# EAGLE design WS2812B-HueStrip (EAGLE 6.6.0)
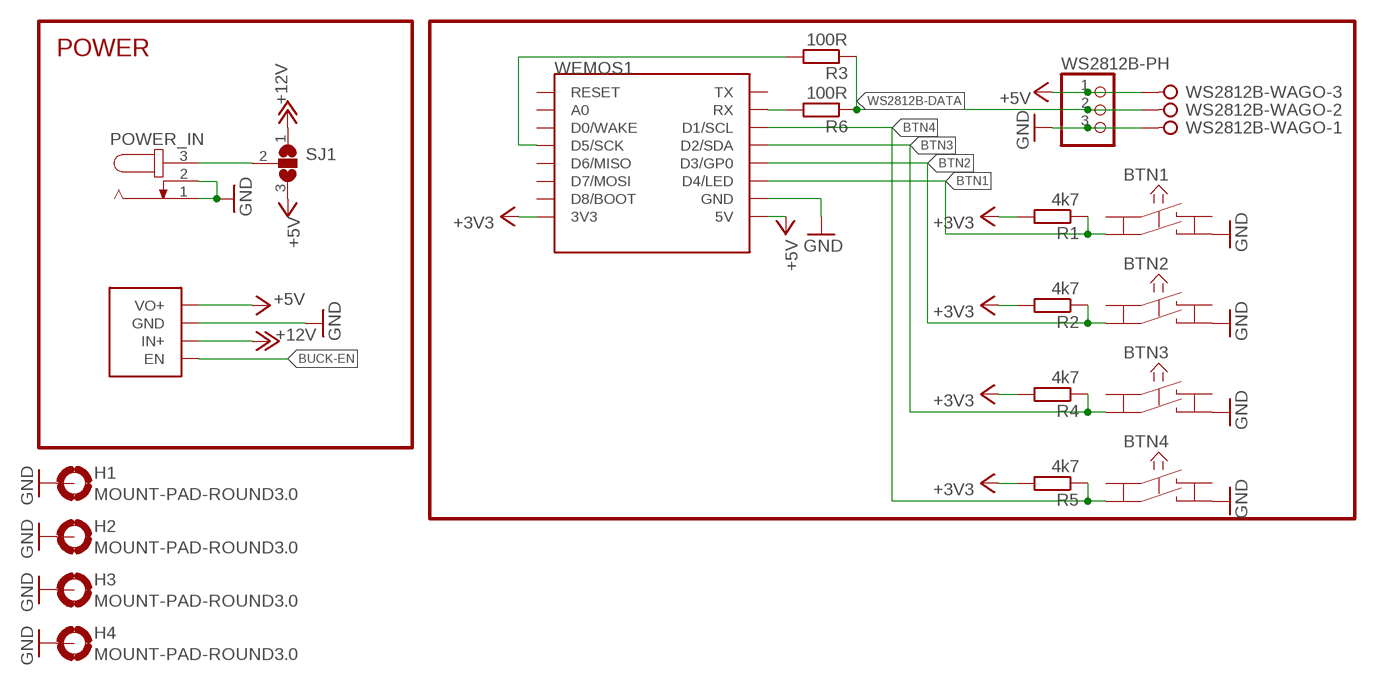
[diagram p0: schematic, sheet 1]

## Parts
BTN1  KSM611A  [KSM611A]
BTN2  KSM611A  [KSM611A]
BTN3  KSM611A  [KSM611A]
BTN4  KSM611A  [KSM611A]
H1  MOUNT-PAD-ROUND3.0  [3,0-PAD]
H2  MOUNT-PAD-ROUND3.0  [3,0-PAD]
H3  MOUNT-PAD-ROUND3.0  [3,0-PAD]
H4  MOUNT-PAD-ROUND3.0  [3,0-PAD]
POWER_IN  RAPC7120  [RAPC712]
R1  4k7  R-EU_MULTI  [MULTI_RESISTOR]
R2  4k7  R-EU_MULTI  [MULTI_RESISTOR]
R3  100R  R-EU_MULTI  [MULTI_RESISTOR]
R4  4k7  R-EU_MULTI  [MULTI_RESISTOR]
R5  4k7  R-EU_MULTI  [MULTI_RESISTOR]
R6  100R  R-EU_MULTI  [MULTI_RESISTOR]
SJ1  SJ2WW  [SJ_2W]
U$1  BUCK_CONVERTER_TE818  [BUCK_CONVERTER_TE818]
WEMOS1  WEMOS-D1-MINI  [WEMOS-D1-MINI]
WS2812B-PH  PINHD-1X03_2.54-S  [1X03-S]
WS2812B-WAGO  W237-3E  [W237-3E]

## Nets
+3V3: R1.2@1 R1.2@2 R2.2@1 R2.2@2 R4.2@1 R4.2@2 R5.2@1 R5.2@2 WEMOS1.3V3
+5V: SJ1.3 U$1.VO+ WEMOS1.5V WS2812B-PH.1 WS2812B-WAGO.3
+12V: SJ1.1 U$1.IN+
BTN1: BTN1.C R1.1@1 R1.1@2 WEMOS1.D4(D4/LED)
BTN2: BTN2.C R2.1@1 R2.1@2 WEMOS1.D3(D3/GP0)
BTN3: BTN3.C R4.1@1 R4.1@2 WEMOS1.D2(D2/SDA)
BTN4: BTN4.C R5.1@1 R5.1@2 WEMOS1.D1(D1/SCL)
BUCK-EN: U$1.EN
GND: BTN1.D BTN2.D BTN3.D BTN4.D H1.B3,0(MOUNT) H2.B3,0(MOUNT) H3.B3,0(MOUNT) H4.B3,0(MOUNT) POWER_IN.1 POWER_IN.2 U$1.GND WEMOS1.GND WS2812B-PH.3 WS2812B-WAGO.1
N$1: POWER_IN.3 SJ1.2
N$2: R3.2@1 R3.2@2 WEMOS1.D5(D5/SCK)
N$3: R6.2@1 R6.2@2 WEMOS1.RX
WS2812B-DATA: R3.1@1 R3.1@2 R6.1@1 R6.1@2 WS2812B-PH.2 WS2812B-WAGO.2
Unconnected: BTN1.A BTN1.B BTN2.A BTN2.B BTN3.A BTN3.B BTN4.A BTN4.B WEMOS1.A0 WEMOS1.D0(D0/WAKE) WEMOS1.D6(D6/MISO) WEMOS1.D7(D7/MOSI) WEMOS1.D8(D8/BOOT) WEMOS1.RESET WEMOS1.TX

## Notes on the sheet
- POWER

## Library data of the parts
BTN1-BTN4 = schalter_taster:KSM611A
H1-H4 = holes:MOUNT-PAD-ROUND: MOUNTING PAD, round
POWER_IN = Arduino Mega 2560:RAPC712: DC POWER JACK Power Jack, DC, Right Angle, Through Hole, Rated 5A at 16VDC, PC Terminals Distributor: Farnell (www.Farnell.de) Drawing: 84N1161.pdf / 84N1162.pdf Manufacturer: SPC Technology (www.spctechnology.com) Type: SPC4077 / SPC 4078
R1-R6 = diyHue:R-EU_MULTI
SJ1 = jumper:SJ2W: SMD solder JUMPER
U$1 = diyHue:BUCK_CONVERTER_TE818
WEMOS1 = esp8266modules:WEMOS-D1-MINI: WeMos.cc D1 mini ESP8266 module
WS2812B-PH = pinhead-2:PINHD-1X03: PIN HEADER
WS2812B-WAGO = con-wago-508:W237-3E: WAGO SREW CLAMP; OC_FARNELL: unknown; OC_NEWARK: unknown

## Board
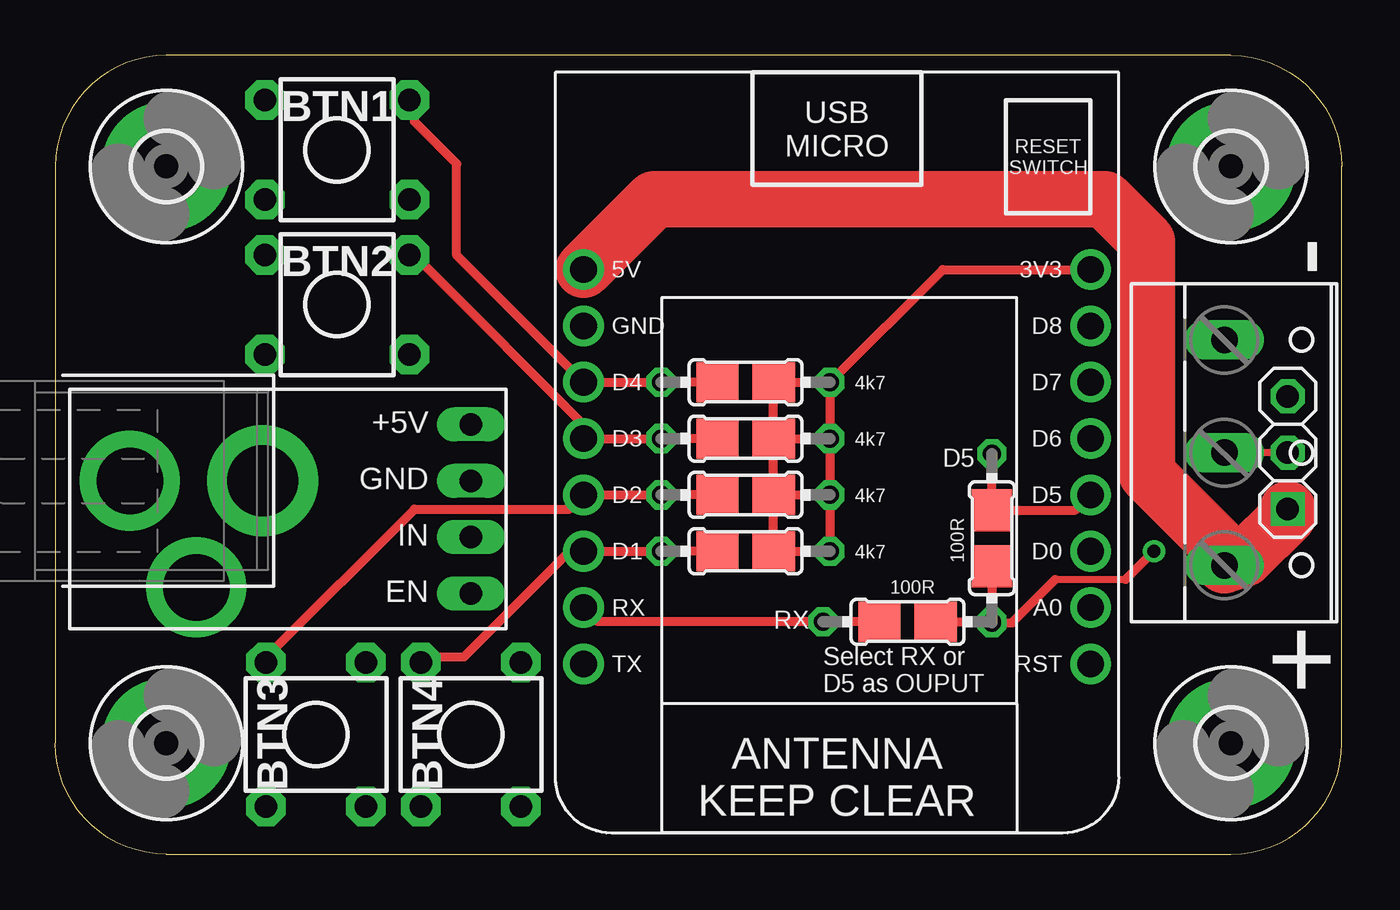
[diagram p1: board, top side]
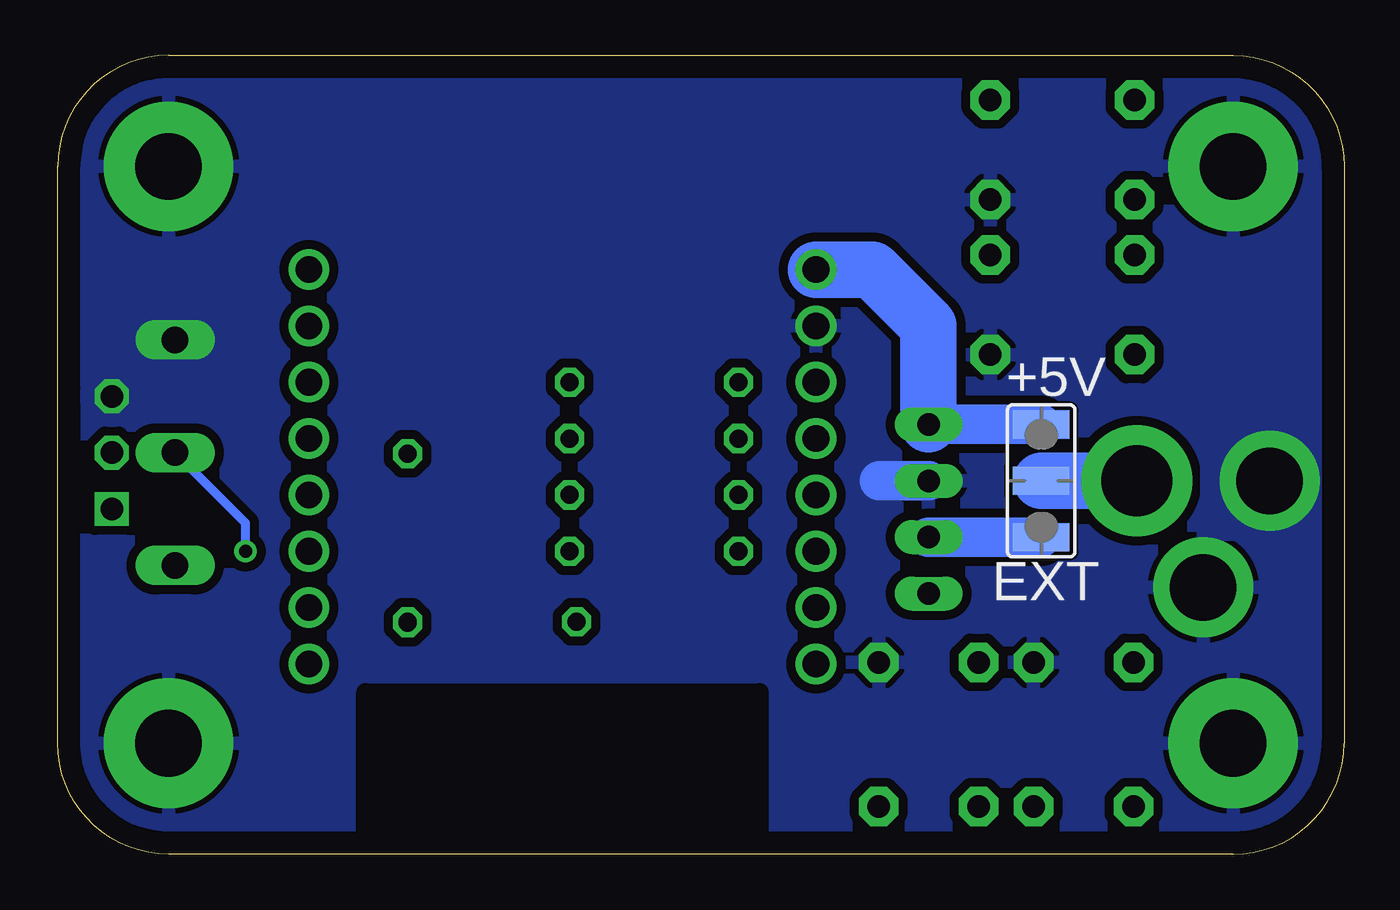
[diagram p2: board, bottom side, seen from below]

Size 58 x 36 mm. Coordinates in mm from the lower left corner, seen from the top.
Outline: 5,0 53,0 arc90 58,5 58,31 arc90 53,36 5,36 arc90 0,31 0,5 arc90 5,0
Copper layers (1*16): Top 0.035mm / dielectric 1.5mm / Bottom 0.035mm
Design rules "default *": minimum track width 10mil, minimum drill 18mil, track to track 8mil, track to pad 8mil, pad to pad 8mil, via to via 8mil, smd to smd 0mil, copper to edge 40mil, drill to drill 8mil, minimum pad ring 10mil, minimum via ring 8mil, stop-mask expansion 4mil, vias tented up to drill 0mil, thermal gap 10mil

### Footprints (pad centres in the part's own frame; a part is rotated, then mirrored left to right if it is on the bottom)
KSM611A = drill 1.016 pad 1.778 octagon: A -3.25,2.25; B -3.25,-2.25; C 3.25,2.25; D 3.25,-2.25
3,0-PAD = drill 3 pad 5.842: B3,0 0,0
RAPC712 = drill 3 pad 4.5: 1 -3,0; 2 0,-4.8 | drill 3.2 pad 5: 3 3,0
MULTI_RESISTOR = drill 0.813 octagon: 1@1 -3.81,0; 2@1 3.81,0 | smd 1.905 x 1.803: 1@2 -1.266,0; 2@2 1.266,0
SJ_2W = smd 1.27 x 2.54: 1 -2.54,0; 2 0,0; 3 2.54,0
BUCK_CONVERTER_TE818 = drill 1.016 long: EN 0,3.81; GND 0,-1.27; IN+ 0,1.27; VO+ 0,-3.81
WEMOS-D1-MINI = drill 1.2 pad 1.829: 3V3 -10.16,-10.16; 5V 12.7,-10.16; A0 -10.16,5.08; D0 -10.16,2.54; D1 12.7,2.54; D2 12.7,0; D3 12.7,-2.54; D4 12.7,-5.08; D5 -10.16,0; D6 -10.16,-2.54; D7 -10.16,-5.08; D8 -10.16,-7.62; GND 12.7,-7.62; RESET -10.16,7.62; RX 12.7,5.08; TX 12.7,7.62
1X03-S = drill 1.016 square: 1 -2.54,0 | drill 1.016 octagon: 2 0,0; 3 2.54,0
W237-3E = drill 1.194 long: 1 -5.08,-0.635; 2 0,-0.635; 3 5.08,-0.635

### Placement (x,y rotation side)
BTN1  12.7,31.75 0 top
BTN2  12.7,24.77 0 top
BTN3  11.75,5.4 90 top
BTN4  18.73,5.4 90 top
H1  5,31 0 top
H2  53,31 0 top
H3  53,5 0 top
H4  5,5 0 top
POWER_IN  6.35,16.83 0 top
R1  31.11,21.27 0 top
R2  31.11,18.73 0 top
R3  42.23,14.24 90 top
R4  31.11,16.19 0 top
R5  31.11,13.65 0 top
R6  38.42,10.48 180 top
SJ1  13.65,16.83 90 bottom
U$1  18.73,15.56 180 top
WEMOS1  36.51,16.19 180 top
WS2812B-PH  55.56,18.1 90 top
WS2812B-WAGO  53.34,18.1 270 top

### Tracks (layer width: path | path; a pad name or v marks a point on that pad's centre or on a via)
+3V3
  Top 0.406: R4.2@1 R5.2@1 R5.2@2 R4.2@2 | R2.2@1 R4.2@1 | R1.2@1 R2.2@1 | WEMOS1.3V3 40.01,26.35 R1.2@1 | R1.2@1 R1.2@2 R2.2@2 | R2.2@2 R2.2@1 | R4.2@2 R4.2@1 | R4.2@2 R2.2@2
+5V
  Top 2.54: WS2812B-PH.1 55.56,15.24 53.66,13.34 WS2812B-WAGO.3 52.39,13.34 52.39,13.97 49.21,17.14 49.21,27.62 47.31,29.53 26.99,29.53 WEMOS1.5V
  Bottom 1.778: SJ1.3 U$1.VO+
  Bottom 2.54: U$1.VO+ 18.73,23.81 21.27,26.35 WEMOS1.5V
+12V
  Bottom 1.778: SJ1.1 U$1.IN+
BTN1
  Top 0.406: BTN1.C 16.19,33.97 16.19,33.02 18.1,31.11 18.1,26.99 WEMOS1.D4 R1.1@1 R1.1@2
BTN2
  Top 0.406: 24.45,18.73 R2.1@1 R2.1@2 | 24.45,18.73 16.19,26.99 BTN2.C | 24.45,18.73 WEMOS1.D3
BTN3
  Top 0.406: BTN3.C 9.53,8.89 16.19,15.56 23.18,15.56 WEMOS1.D2 R4.1@1 R4.1@2
BTN4
  Top 0.406: BTN4.C 16.51,8.89 18.41,8.89 23.18,13.65 WEMOS1.D1 R5.1@1 R5.1@2
GND
  Bottom 1.778: U$1.GND 20.95,16.83
  pour Bottom (isolate 0.406): -0.95,37.47 59.07,37.47 59.07,-0.95 -0.95,-0.95
  pour Bottom (no thermals): -1.91,20.95 6.35,20.95 6.35,14.29 -1.91,14.29
  pour Bottom (isolate 0.406, no thermals): 50.8,25.08 56.83,25.08 56.83,11.11 50.8,11.11
N$1
  Bottom 2.54: POWER_IN.3 SJ1.2
N$2
  Top 0.406: WEMOS1.D5 45.99,15.51 R3.2@2 R3.2@1
N$3
  Top 0.406: R6.2@2 R6.2@1 24.45,10.48 WEMOS1.RX
WS2812B-DATA  (via drill 0.6)
  Top 0.305: WS2812B-PH.2 WS2812B-WAGO.2 | 45.09,12.38 48.26,12.38
  Top 0.406: R3.1@2 R6.1@1 R3.1@1 | R3.1@1 43.13,10.43 45.09,12.38 | 48.26,12.38 v49.53,13.65 | R6.1@2 42.18,10.48 R3.1@1
  Bottom 0.406: v49.53,13.65 49.53,14.92 WS2812B-WAGO.2

### Text on the board
tPlace: - | D5 | RX | Select RX or / D5 as OUPUT | +
bPlace: +5V | EXT